# EasyEDA Pro project NUEVO board Rev. B.epro, board Amazon_B074TH1719
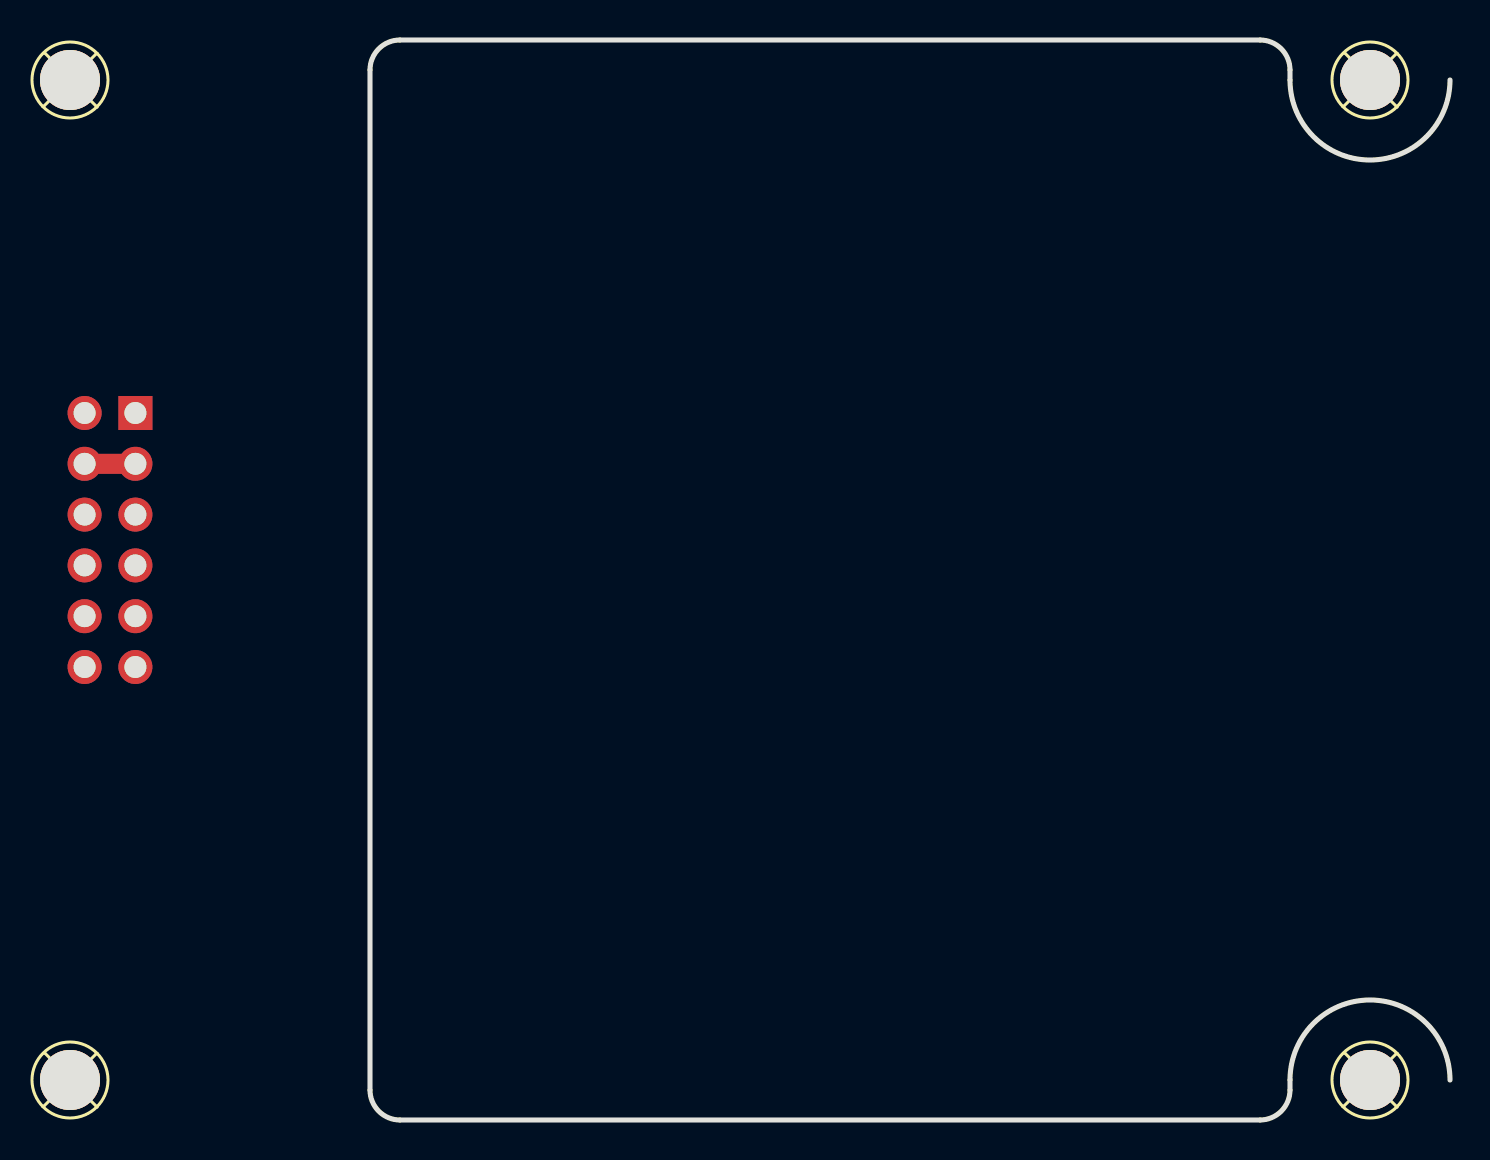
[diagram p8: board, top side]
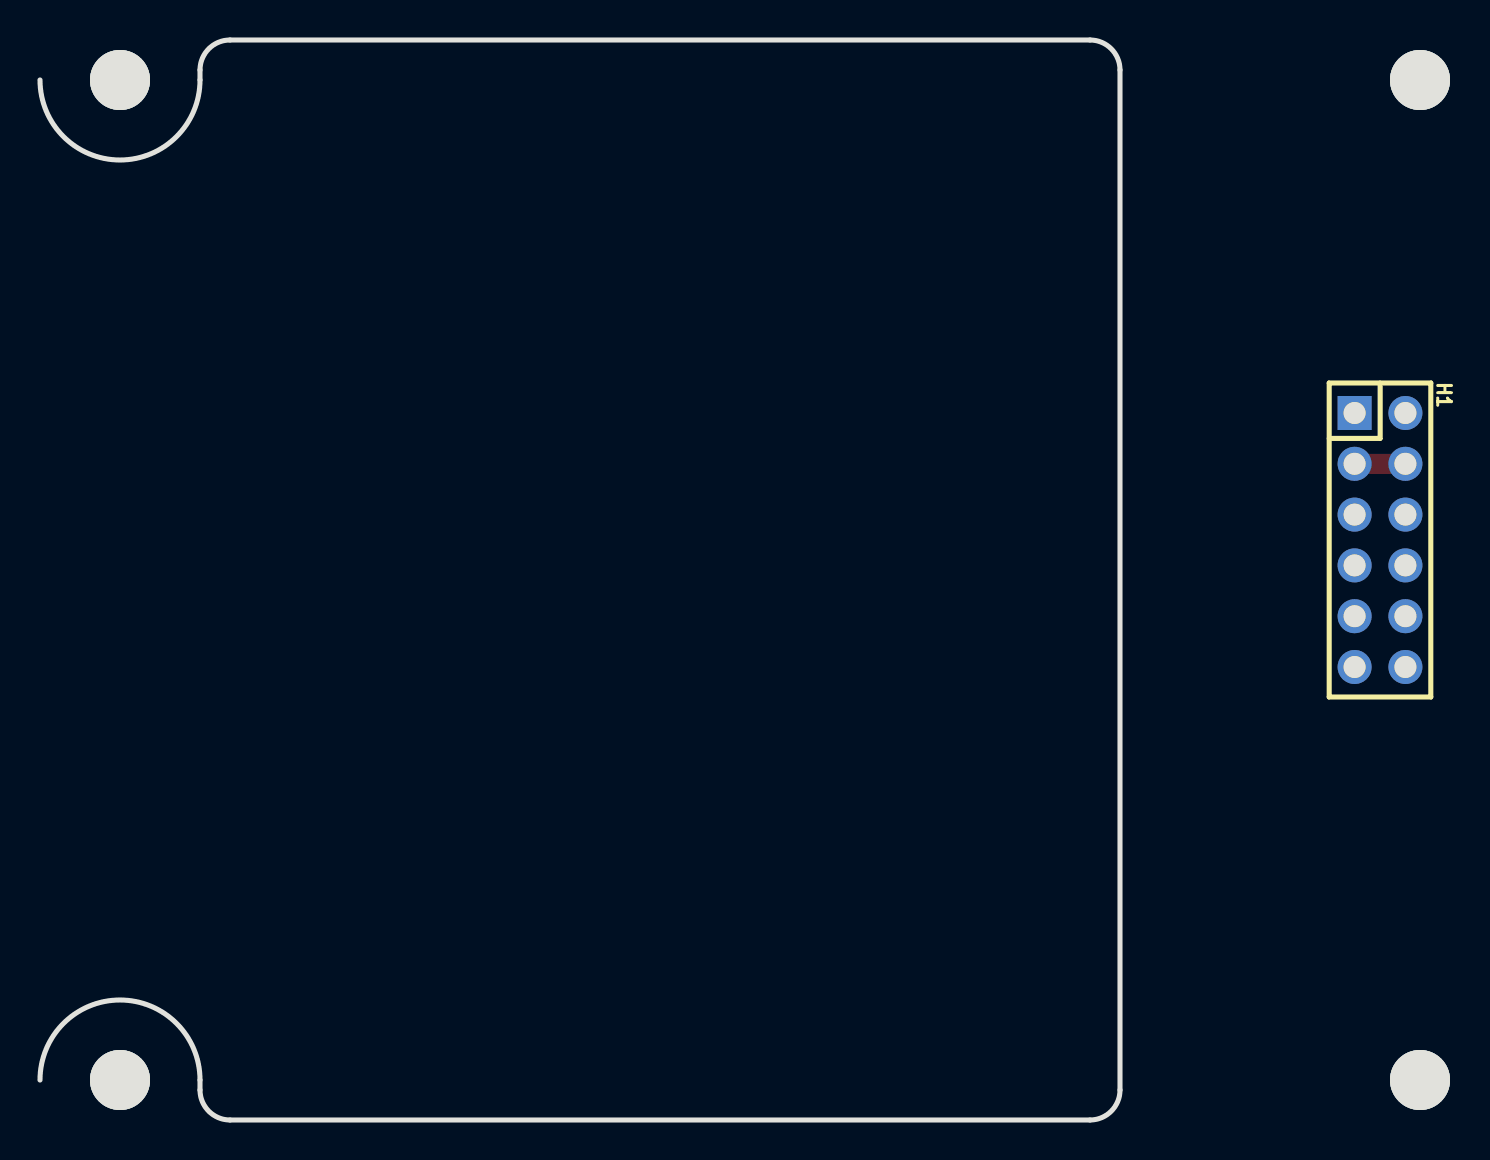
[diagram p9: board, bottom side, seen from below]

Outline 54 x 54 mm; copper layers: Top Layer, Bottom Layer. Coordinates in mm from the lower left corner of the outline.
Outline path: 54,2 arc(50,6) 46,2 46,1.5 arc(45.56,0.44) 44.5,0 1.5,0 arc(0.44,0.44) 0,1.5 0,52.5 arc(0.44,53.56) 1.5,54 44.5,54 arc(45.56,53.56) 46,52.5 46,52 arc(50,48) 54,52
Stack: Top Layer 0.035mm / Dielectric1 1.51mm FR4 er 4.5 / Bottom Layer 0.035mm

## Design rules (mm)
template: JLCPCB Capability(Two Layers Board)
spacing copperThickness1oz (default): track to track 0.102, other pairs 0.152 to 0.3
spacing copperThickness2oz: track to track 0.203, other pairs 0.152 to 0.3
track width copperThickness1oz (default): min 0.127, default 0.254, max 2.54
track width copperThickness2oz: min 0.203, default 0.254, max 2.54
differential pair differentialPair (default): width min 0.127, default 0.254, max 2.54; gap min 0.152, default 0.152
via viaSize (default): diameter min 0.5, default 0.61, max 10; hole min 0.3, default 0.305, max 6.3

## Placement (name value [footprint] x y rotation side)
H1  2.54-2*6P母  [HDR-TH_12P-P2.54-V-F-R2-C6-S2.54]  -13 29 270 bottom
SCREW1  -  [Screw-Hole-M2]  -15 2 0 top
SCREW2  -  [Screw-Hole-M2]  50 2 0 top
SCREW3  -  [Screw-Hole-M2]  50 52 0 top
SCREW4  -  [Screw-Hole-M2]  -15 52 0 top

## Footprints (pads in the part's own frame, mm; a bottom-side part is the same pattern mirrored in y, then rotated)
HDR-TH_12P-P2.54-V-F-R2-C6-S2.54
  rect 1.7x1.7 hole 1.1: 1(-6.35,-1.27)
  round 1.7 hole 1.1: 2(-6.35,1.27) 3(-3.81,-1.27) 4(-3.81,1.27) 5(-1.27,-1.27) 6(-1.27,1.27) 7(1.27,-1.27) 8(1.27,1.27) 9(3.81,-1.27) 10(3.81,1.27) 11(6.35,-1.27) 12(6.35,1.27)
Screw-Hole-M2
  round 3 hole 3: 1(0,0)

## Nets
As in the schematic.

Pads without a net: H1 1 2; SCREW1 1; SCREW2 1; SCREW3 1; SCREW4 1

## Routing (per net, layer and track width the routed paths; a pad name or vN(x,y) marks a point on that pad's centre or on a via; arc(x,y) is an arc through that point)
GND: length 2.5
  Top Layer w1: H1.4 H1.3
